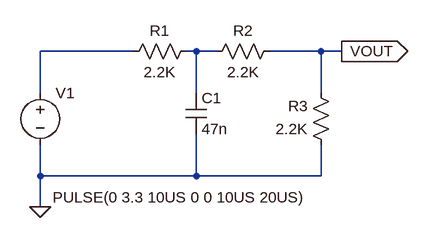
[diagram p0: schematic Draft1.asc]
Draft1.asc, the LTspice schematic file:
Version 4
SHEET 1 880 680
WIRE 240 80 96 80
WIRE 336 80 320 80
WIRE 368 80 336 80
WIRE 528 80 448 80
WIRE 560 80 528 80
WIRE 96 144 96 80
WIRE 336 144 336 80
WIRE 528 144 528 80
WIRE 96 272 96 224
WIRE 336 272 336 208
WIRE 336 272 96 272
WIRE 528 272 528 224
WIRE 528 272 336 272
WIRE 96 320 96 272
FLAG 96 320 0
FLAG 560 80 VOUT
IOPIN 560 80 Out
SYMBOL voltage 96 128 R0
WINDOW 3 19 177 Left 2
WINDOW 123 0 0 Left 0
WINDOW 39 0 0 Left 0
SYMATTR InstName V1
SYMATTR Value PULSE(0 3.3 10US 0 0 10US 20US)
SYMBOL res 336 64 R90
WINDOW 0 0 56 VBottom 2
WINDOW 3 32 56 VTop 2
SYMATTR InstName R1
SYMATTR Value 2.2K
SYMBOL res 464 64 R90
WINDOW 0 0 56 VBottom 2
WINDOW 3 32 56 VTop 2
SYMATTR InstName R2
SYMATTR Value 2.2K
SYMBOL res 544 240 R180
WINDOW 0 36 76 Left 2
WINDOW 3 36 40 Left 2
SYMATTR InstName R3
SYMATTR Value 2.2K
SYMBOL cap 320 144 R0
SYMATTR InstName C1
SYMATTR Value 47n

The netlist it stands for:
* Draft1.asc
V1 N001 0 PULSE(0 3.3 10US 0 0 10US 20US)
R1 N002 N001 2.2K
R2 VOUT N002 2.2K
R3 0 VOUT 2.2K
C1 N002 0 47n
.backanno
.end